# Altium schematic sheet 1. Power.SchDoc
size A3
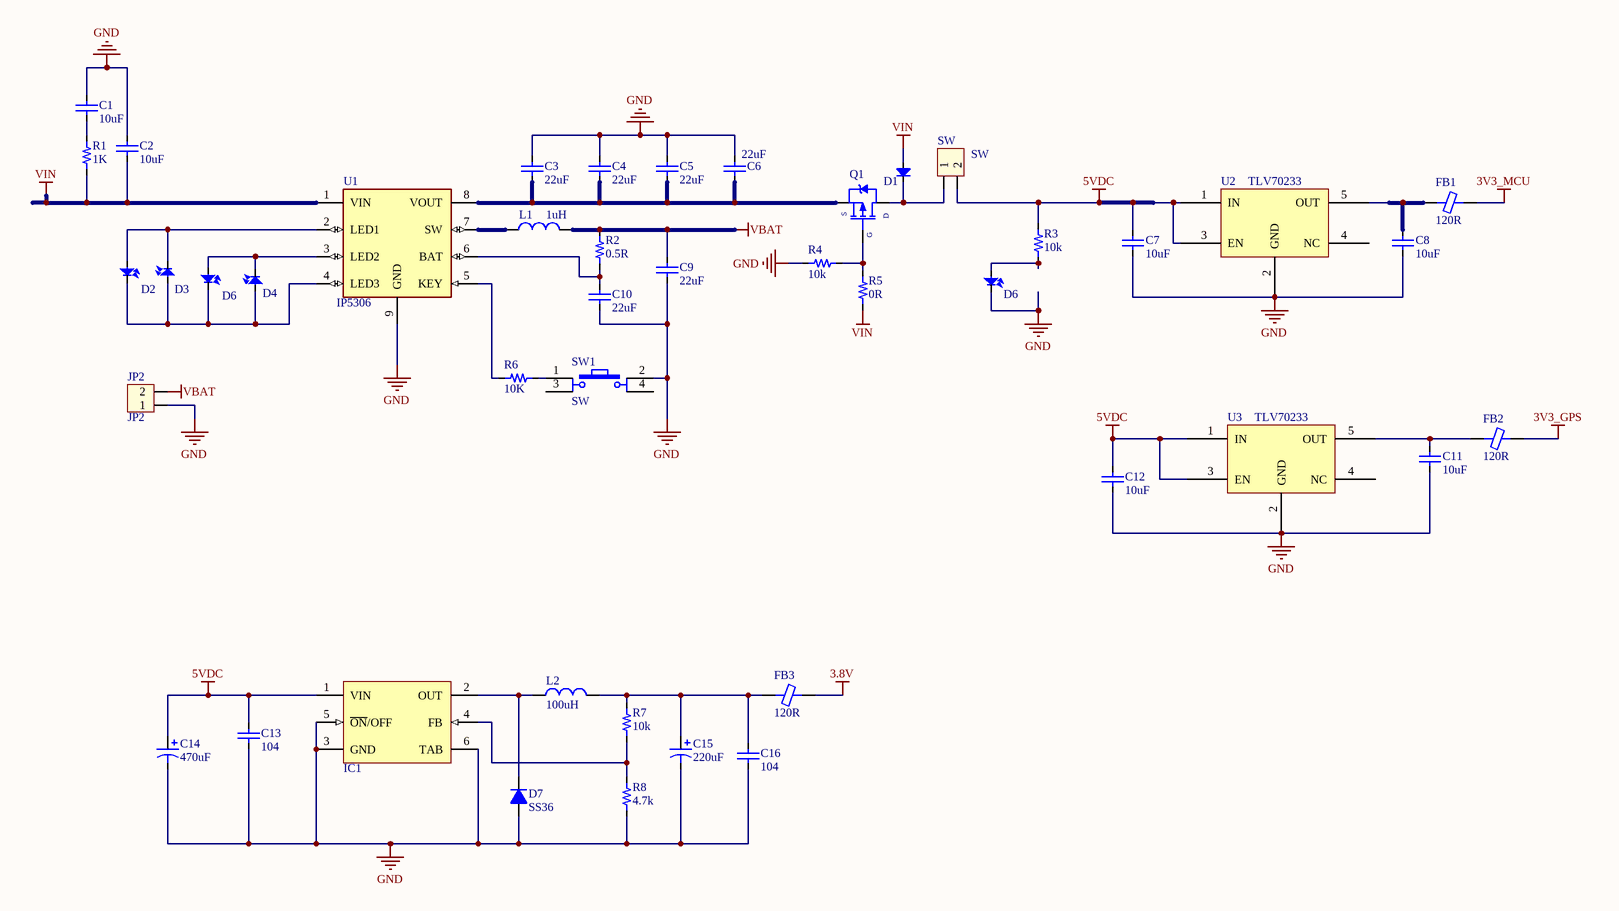
[diagram p0: 1. Power.SchDoc]

## Parts
(Parts that share a designator on the sheet are numbered #1, #2 ... from top to bottom, then left to right.)
C1  10uF  [CAP_0603]
C2  10uF  [CAP_0603]
C3  22uF  [CAP_0603]
C4  22uF  [CAP_0603]
C5  22uF  [CAP_0603]
C6  22uF  [CAP_0603]
C7  10uF  [CAP_0603]
C8  10uF  [CAP_0603]
C9  22uF  [CAP_0603]
C10  22uF  [CAP_0603]
C11  10uF  [CAP_0603]
C12  10uF  [CAP_0603]
C13  104  [CAP_0603]
C14  470uF  [CAP-ALU-SMD-F]
C15  220uF  [TANTALUM]
C16  104  [CAP_0603]
D1  Diode  [SOD-123]  (value not drawn)
D2  LED  [LED-0603-Red]  (value not drawn)
D3  LED  [LED-0603-Red]  (value not drawn)
D4  LED  [LED-0603-Red]  (value not drawn)
D6#1  LED  [LED-0603-Red]  (value not drawn)
D6#2  LED  [LED-3]  (value not drawn)
D7  SS36  [DO-214AC(SMA)]
FB1  120R  [RES-SMD-0603]
FB2  120R  [RES-SMD-0603]
FB3  120R  [RES-SMD-1206]
IC1  LM2576  [LM2596]  (value not drawn)
JP2  JP2  [CON2]
L1  1uH  [Inductor SMD 0630]
L2  100uH  [CD75-220]
Q1  AO3401A  [AO3407A]  (value not drawn)
R1  1K  [RES-SMD-0603]
R2  0.5R  [RES-SMD-0603]
R3  10k  [RES-SMD-0603]
R4  10k  [RES-SMD-0603]
R5  0R  [RES-SMD-0603]
R6  10K  [RES-SMD-0603]
R7  10k  [RES-SMD-0603]
R8  4.7k  [RES-SMD-0603]
SW  SW  [CON2]
SW1  SW  [SW4]
U1  IP5306  [IP5306]
U2  Name: TLV70233  [SOT23-5]  (hidden comment: TLV70223)
U3  Name: TLV70233  [SOT23-5]  (hidden comment: TLV70223)

## Nets
3.8V: FB3.1
3V3_GPS: FB2.1
3V3_MCU: FB1.1
5VDC: C7.2 C12.2 C13.1 C14.1 IC1.1(VIN) R3.1 SW.2 U2.1(IN) U2.3(EN) U3.1(IN) U3.3(EN)
GND: C1.2 C2.2 C3.2 C4.2 C5.2 C6.2 C7.1 C8.1 C9.1 C10.1 C11.1 C12.1 C13.2 C14.2 C15.2 C16.2 D6#2.2 D7.1(A) IC1.3(GND) IC1.5(~{ON}/OFF) IC1.6(TAB) JP2.1 R4.1 R8.1 SW1.2 U1.9(GND) U2.2(GND) U3.2(GND)
VBAT: C9.2 JP2.2 L1.2 R2.2
VIN: C2.1 D1.1(A) R1.1 R5.2 U1.1(VIN)
NetC1_1: C1.1 R1.2
NetC3_1: C3.1 C4.1 C5.1 C6.1 Q1.2(S) U1.8(VOUT)
NetC8_2: C8.2 FB1.2 U2.5(OUT)
NetC10_2: C10.2 R2.1 U1.6(BAT)
NetC11_2: C11.2 FB2.2 U3.5(OUT)
NetC15_1: C15.1 C16.1 FB3.2 L2.2 R7.2
NetD1_2: D1.2(K) Q1.3(D) SW.1
NetD2_1: D2.1 D3.2 U1.2(LED1)
NetD2_2: D2.2 D3.1 D4.1 D6#1.2 U1.4(LED3)
NetD4_2: D4.2 D6#1.1 U1.3(LED2)
NetD6#2_1: D6#2.1 R3.2
NetD7_2: D7.2(K) IC1.2(OUT) L2.1
NetIC1_4: IC1.4(FB) R7.1 R8.2
NetL1_1: L1.1 U1.7(SW)
NetQ1_1: Q1.1(G) R4.2 R5.1
NetR6_1: R6.1 SW1.1
NetR6_2: R6.2 U1.5(KEY)

Not connected (* = marked no-connect by the designer): SW1 3 4; U2 4(NC); U3 4(NC)

## Library data of the parts
C1-C13 C16 = CapSMD: Capacitor; Value: 33p; Published: 8-Jun-2000; LatestRevisionDate: 17-Jul-2002; LatestRevisionNote: Re-released for DXP Platform.; PackageReference: RAD-0.3; Publisher: Altium Limited
C14 C15 = Cap Pol: Polarized Capacitor (Axial); Published: 8-Jun-2000; LatestRevisionDate: 17-Jul-2002; LatestRevisionNote: Re-released for DXP Platform.; PackageReference: POLAR0.8; Publisher: Altium Limited
D1 = Diode: Default Diode; Code - JEDEC: DO-214-AB; Value: 1N5007; Published: 8-Jun-2000; Revision: July-2002: Re-released for DXP Platform.; Publisher: Altium Limited
D2-D4 D6#1 D6#2 = LED: LED Single colour Green and Red; Value: LED 3 ly Single Colour
D7 = B340A: Diode Schottky 40V 3A Surface Mount DO-214AC (SMA); Manufacturer: Vishay General Semiconductor - Diodes Division; Part number: B340A-M3/61T; User_Description: DIODE SCHOTTKY 40V 3A DO214AC; Value: 40V 3A; Category: DIODE; Package: DO214AC
FB1-FB3 = Ferrite beads
JP2 SW = Con2: Connector 2; Value: Connector 2
L1 = L1: Inductor; Value: 150 mH
L2 = L1: 22µH Shielded Inductor 1.65A 96mOhm Max Nonstandard; Manufacturer: Bourns Inc.; Part Number: SRR0745A-220M; Value: 220uH; User_Description: FIXED IND 22UH 1.65A 96 MOHM SMD; Category: INDUCTORS; Package: SMD
Q1 = AO3407A
R1-R8 = Resistor - SMD: Resistor; Manufacturer: Generic Components; Class: Passive; Published: 08/06/2000; Publisher: Altium Hobart Technology Centre
SW1 = SW4: Switch button 4 pin; Value: Button chip 4 pin
U1 = IP5306: IP5306 LiPo Charger Booster
U2 U3 = TLV70223: IC æn ¸p TLV70233, d¸n; Package: SOT23-5